# Altium schematic sheet CPLD.SchDoc
size A4 portrait; DocumentNumber: 13; SheetNumber: 13; SheetTotal: 16
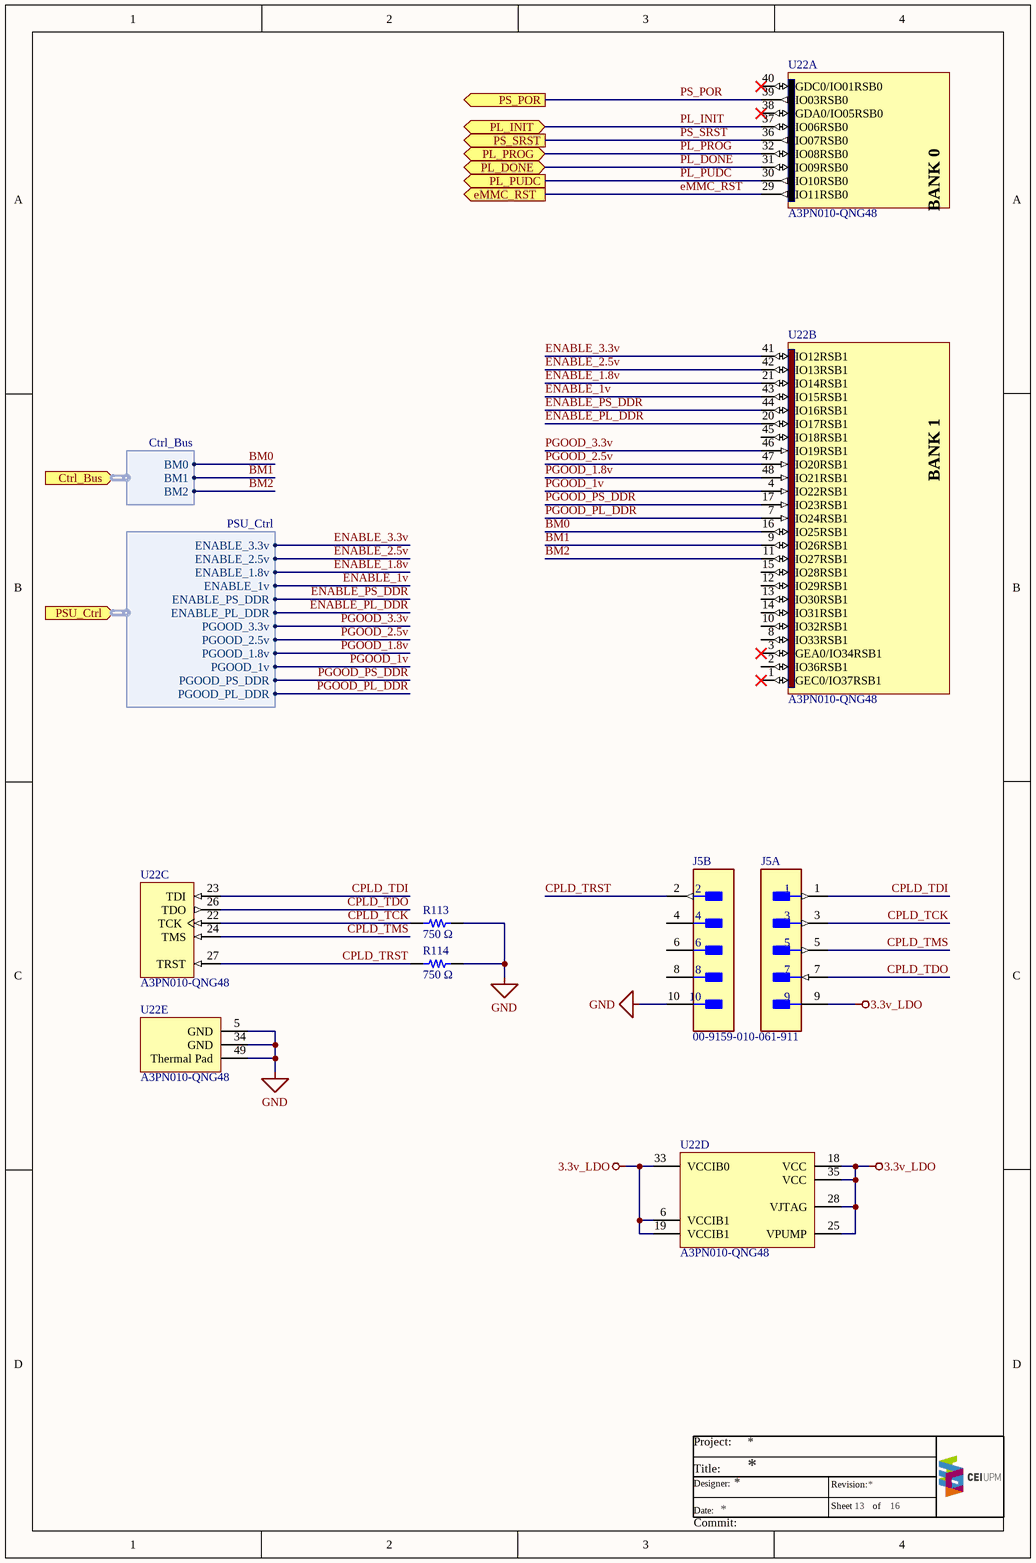
[diagram p0: CPLD.SchDoc]

## Parts
J5  00-9159-010-061-911  [KYOCERA_00-9159-010-061-911]  (value not drawn)  (parts A,B of 2)
R113  750 Ω  [PANASONIC_ERJ2G_0402]
R114  750 Ω  [PANASONIC_ERJ2G_0402]
U22  A3PN010-QNG48  [Actel_QN48]  (parts A,B,C,D,E of 5)

## Ports
Ctrl_Bus (in, harness Ctrl_Bus), eMMC_RST (out), PL_DONE (bidir), PL_INIT (bidir), PL_PROG (bidir), PL_PUDC (out), PS_POR (out), PS_SRST (out), PSU_Ctrl (in, harness PSU_Ctrl)

## Harnesses
Ctrl_Bus: BM0, BM1, BM2
PSU_Ctrl: ENABLE_3.3v, ENABLE_2.5v, ENABLE_1.8v, ENABLE_1v, ENABLE_PS_DDR, ENABLE_PL_DDR, PGOOD_3.3v, PGOOD_2.5v, PGOOD_1.8v, PGOOD_1v, PGOOD_PS_DDR, PGOOD_PL_DDR

## Nets
3.3v_LDO: J5.9 U22.6(VCCIB1) U22.18(VCC) U22.19(VCCIB1) U22.25(VPUMP) U22.28(VJTAG) U22.33(VCCIB0) U22.35(VCC)
GND: J5.10 R113.2 R114.2 U22.5(GND) U22.34(GND) U22.49(Thermal_Pad)
BM0: U22.16(IO25RSB1) ; port Ctrl_Bus.BM0
BM1: U22.9(IO26RSB1) ; port Ctrl_Bus.BM1
BM2: U22.11(IO27RSB1) ; port Ctrl_Bus.BM2
CPLD_TCK: J5.3 R113.1 U22.22(TCK)
CPLD_TDI: J5.1 U22.23(TDI)
CPLD_TDO: J5.7 U22.26(TDO)
CPLD_TMS: J5.5 U22.24(TMS)
CPLD_TRST: J5.2 R114.1 U22.27(TRST)
eMMC_RST: U22.29(IO11RSB0) ; port eMMC_RST
ENABLE_1.8v: U22.21(IO14RSB1) ; port PSU_Ctrl.ENABLE_1.8v
ENABLE_1v: U22.43(IO15RSB1) ; port PSU_Ctrl.ENABLE_1v
ENABLE_2.5v: U22.42(IO13RSB1) ; port PSU_Ctrl.ENABLE_2.5v
ENABLE_3.3v: U22.41(IO12RSB1) ; port PSU_Ctrl.ENABLE_3.3v
ENABLE_PL_DDR: U22.20(IO17RSB1) ; port PSU_Ctrl.ENABLE_PL_DDR
ENABLE_PS_DDR: U22.44(IO16RSB1) ; port PSU_Ctrl.ENABLE_PS_DDR
PGOOD_1.8v: U22.48(IO21RSB1) ; port PSU_Ctrl.PGOOD_1.8v
PGOOD_1v: U22.4(IO22RSB1) ; port PSU_Ctrl.PGOOD_1v
PGOOD_2.5v: U22.47(IO20RSB1) ; port PSU_Ctrl.PGOOD_2.5v
PGOOD_3.3v: U22.46(IO19RSB1) ; port PSU_Ctrl.PGOOD_3.3v
PGOOD_PL_DDR: U22.7(IO24RSB1) ; port PSU_Ctrl.PGOOD_PL_DDR
PGOOD_PS_DDR: U22.17(IO23RSB1) ; port PSU_Ctrl.PGOOD_PS_DDR
PL_DONE: U22.31(IO09RSB0) ; port PL_DONE
PL_INIT: U22.37(IO06RSB0) ; port PL_INIT
PL_PROG: U22.32(IO08RSB0) ; port PL_PROG
PL_PUDC: U22.30(IO10RSB0) ; port PL_PUDC
PS_POR: U22.39(IO03RSB0) ; port PS_POR
PS_SRST: U22.36(IO07RSB0) ; port PS_SRST

Not connected (* = marked no-connect by the designer): J5 4 6 8; U22 1(GEC0/IO37RSB1)* 2(IO36RSB1) 3(GEA0/IO34RSB1)* 8(IO33RSB1) 10(IO32RSB1) 12(IO29RSB1) 13(IO30RSB1) 14(IO31RSB1) 15(IO28RSB1) 38(GDA0/IO05RSB0)* 40(GDC0/IO01RSB0)* 45(IO18RSB1)

## Notes on the sheet
- Project:
- Title:
- Date:
- Designer:
- Sheet
- Revision:
- of
- Commit:
- (in symbol A3PN010-QNG48, part A) BANK 0
- (in symbol A3PN010-QNG48, part B) BANK 1

## Library data of the parts
J5 = 00-9159-010-061-911: Coplanar Open Ended Card Edge Connector 10 Pin; Supplier 1: Digi-Key; Supplier Part Number 1: 478-009159010061911-ND
R113 R114 = ERJ2RKF7500X: General Purpose Thick Film Chip Resistors; Manufacturer: Panasonic; Power (0402): 0.1 W; Limiting Voltage (0402): 50; Maximum Voltage (0402): 100; Resistance Range (Ω): 1Ω to 100MΩ; AEC 200: Grade 0; Size (0402): 2GE; ComponentLink1Description: Catalog; ComponentLink1URL: https://industrial.panasonic.com/ww/products/pt/general-purpose-chip-resistors/models?op=search&model_status_current=1&page=0#model-list-search-results; Series: ERJ; Temperature Range (ºC): -55 to +155; Supplier 1: Avnet; Supplier Part Number 1: 73T6541
U22 = A3PN010-QNG48: ProASIC3 nano Flash FPGA, 34 User IOs, 10K System Gates, Standard Speed, 48-Pin QFP, Pb-Free, Commerical Grade; System Gates: 100.000; Equivalent LEs: 100; FlashROM Bits: 1024; Maximum User I/Os: 34; ComponentLink1Description: Manufacturer; ComponentLink1URL: https://www.microsemi.com/product-directory/fpgas/1690-proasic3#proasic3-nano; Supplier 1: Digi-Key; Supplier Part Number 1: 1100-1258-ND; Package: QNG48